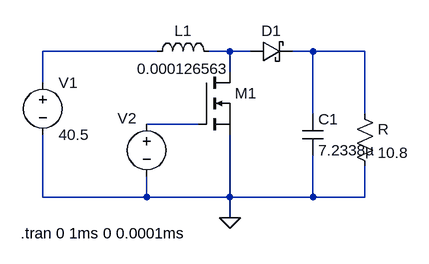
[diagram p0: schematic passive components boost.asc]
passive components boost.asc, the LTspice schematic file:
Version 4
SHEET 1 880 680
WIRE 96 48 -80 48
WIRE 208 48 176 48
WIRE 240 48 208 48
WIRE 336 48 304 48
WIRE 416 48 336 48
WIRE 208 80 208 48
WIRE -80 96 -80 48
WIRE 336 144 336 48
WIRE 416 144 416 48
WIRE 160 160 80 160
WIRE -80 272 -80 176
WIRE 80 272 80 240
WIRE 80 272 -80 272
WIRE 208 272 208 176
WIRE 208 272 80 272
WIRE 336 272 336 208
WIRE 336 272 208 272
WIRE 416 272 416 224
WIRE 416 272 336 272
WIRE 208 304 208 272
FLAG 208 304 0
SYMBOL voltage -80 80 R0
WINDOW 123 0 0 Left 2
WINDOW 39 0 0 Left 2
SYMATTR InstName V1
SYMATTR Value 40.5
SYMBOL voltage 80 144 R0
WINDOW 0 -45 7 Left 2
WINDOW 3 24 96 Invisible 2
WINDOW 123 0 0 Left 2
WINDOW 39 0 0 Left 2
SYMATTR InstName V2
SYMATTR Value PULSE(0 3.3 0 0 0 1.5625u 6.25u)
SYMBOL ind 80 64 R270
WINDOW 0 32 56 VTop 2
WINDOW 3 5 56 VBottom 2
SYMATTR InstName L1
SYMATTR Value 0.000126563
SYMBOL cap 320 144 R0
SYMATTR InstName C1
SYMATTR Value 7.2338µ
SYMBOL res 400 128 R0
SYMATTR InstName R
SYMATTR Value 10.8
SYMBOL schottky 240 64 R270
WINDOW 0 32 32 VTop 2
WINDOW 3 0 32 Invisible 2
SYMATTR InstName D1
SYMATTR Value 10MQ060N
SYMATTR Description Diode
SYMATTR Type diode
SYMBOL nmos 160 80 R0
WINDOW 3 94 221 Invisible 2
SYMATTR InstName M1
SYMATTR Value BSB017N03LX3
TEXT -114 328 Left 2 !.tran 0 1ms 0 0.0001ms

The netlist it stands for:
* passive components boost.asc
V1 N001 0 40.5
V2 N004 0 PULSE(0 3.3 0 0 0 1.5625u 6.25u)
L1 N001 N002 0.000126563
C1 N003 0 7.2338µ
R N003 0 10.8
D1 N002 N003 10MQ060N
M1 N002 N004 0 0 BSB017N03LX3
.model D D
.lib standard.dio
.model NMOS NMOS
.model PMOS PMOS
.lib standard.mos
.tran 0 1ms 0 0.0001ms
.backanno
.end